# EAGLE schematic EnguinoAuxDisplaySchematic (EAGLE 8.3.1)
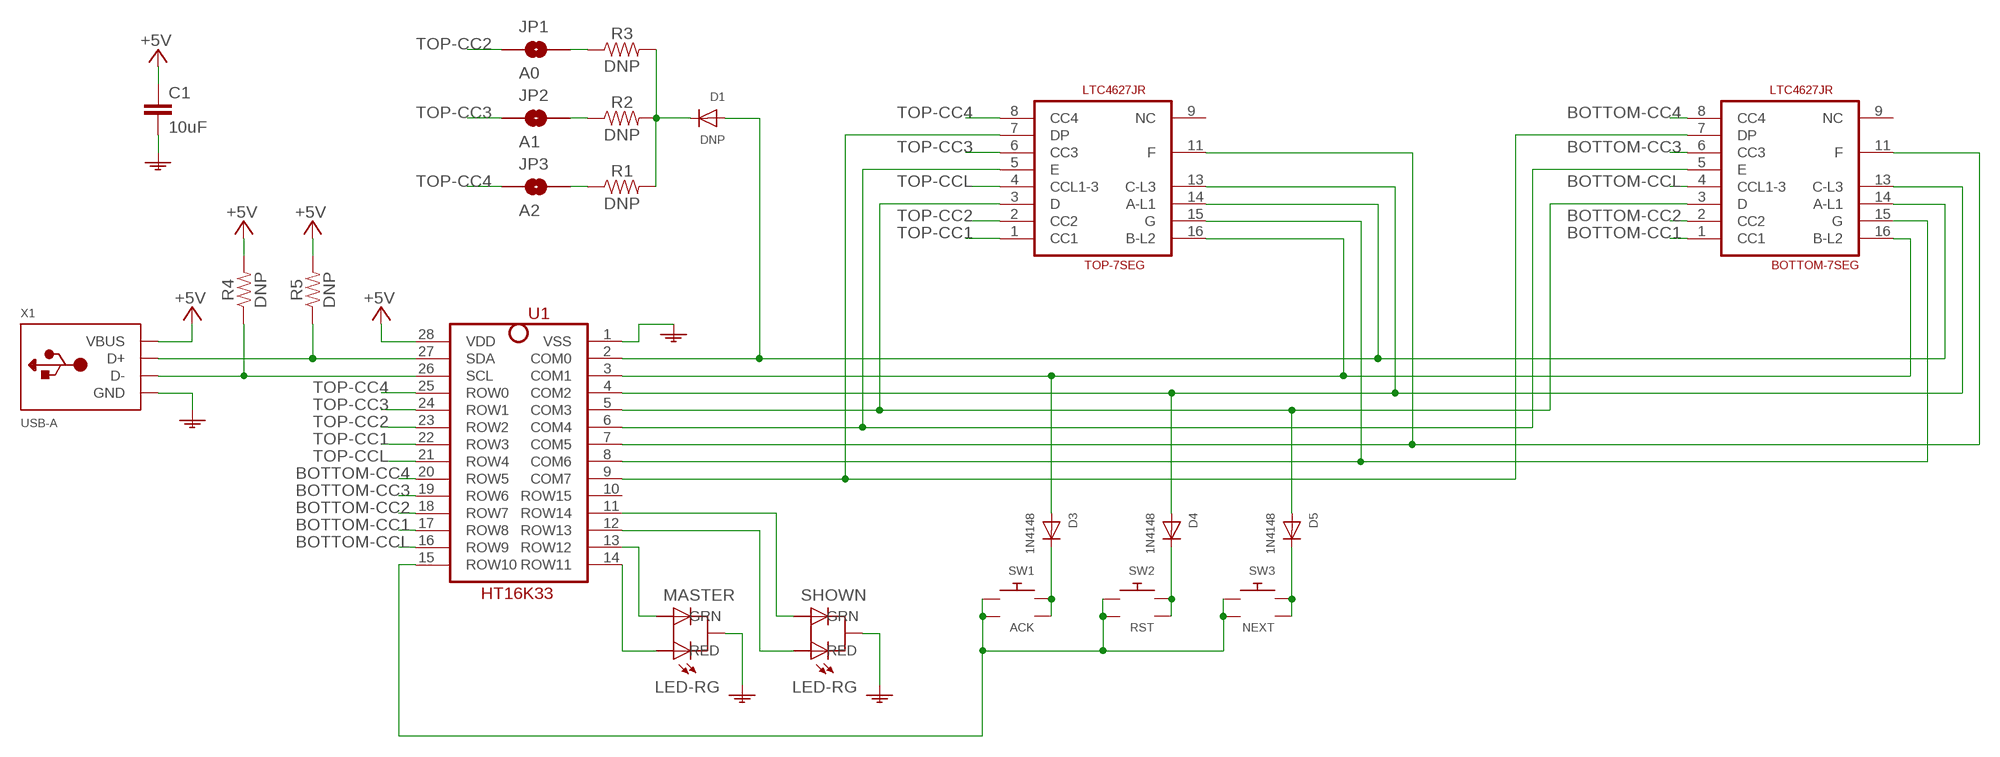
[diagram p0: schematic, sheet 1]

## Parts
BOTTOM-7SEG  LTC4627JR  [7SEG-LED]
C1  10uF  10UF-0805-10V-10%  [0805]
D1  DNP  DIODESOD-123  [SOD-123]
D3  1N4148  DIODESOD-123  [SOD-123]
D4  1N4148  DIODESOD-123  [SOD-123]
D5  1N4148  DIODESOD-123  [SOD-123]
JP1  A0  JUMPER-SMT_2_NO_SILK  [SMT-JUMPER_2_NO_SILK]
JP2  A1  JUMPER-SMT_2_NO_SILK  [SMT-JUMPER_2_NO_SILK]
JP3  A2  JUMPER-SMT_2_NO_SILK  [SMT-JUMPER_2_NO_SILK]
MASTER  LED-RG  [LED-2-5MM]
R1  DNP  47KOHM-0603-1/10W-1%  [0603]
R2  DNP  47KOHM-0603-1/10W-1%  [0603]
R3  DNP  47KOHM-0603-1/10W-1%  [0603]
R4  DNP  22KOHM-0603-1/10W-1%  [0603]
R5  DNP  22KOHM-0603-1/10W-1%  [0603]
SHOWN  LED-RG  [LED-2-5MM]
SW1  ACK  PUSHBUTTON  [BUTTON-TH]
SW2  RST  PUSHBUTTON  [BUTTON-TH]
SW3  NEXT  PUSHBUTTON  [BUTTON-TH]
TOP-7SEG  LTC4627JR  [7SEG-LED]
U1  HT16K33  [SOP28]
X1  USB-A  [USB-A-AMPHENOL]

## Nets
0V: C1.2 MASTER.2(CC) SHOWN.2(CC) U1.1(VSS) X1.P$4(GND)
1N41N8: SW1.3 SW1.4 SW2.3 SW2.4 SW3.3 SW3.4 U1.15(ROW10)
+5V: C1.1 R4.2 R5.2 U1.28(VDD) X1.P$1(VBUS)
BOTTOM-CC1: BOTTOM-7SEG.1(CC1) U1.17(ROW8)
BOTTOM-CC2: BOTTOM-7SEG.2(CC2) U1.18(ROW7)
BOTTOM-CC3: BOTTOM-7SEG.6(CC3) U1.19(ROW6)
BOTTOM-CC4: BOTTOM-7SEG.8(CC4) U1.20(ROW5)
BOTTOM-CCL: BOTTOM-7SEG.4(CCL1-3) U1.16(ROW9)
N$1: JP1.2 R3.1
N$2: R5.1 U1.27(SDA) X1.P$3(D+)
N$3: BOTTOM-7SEG.14(A-L1) D1.A TOP-7SEG.14(A-L1) U1.2(COM0)
N$4: BOTTOM-7SEG.16(B-L2) D3.A TOP-7SEG.16(B-L2) U1.3(COM1)
N$5: BOTTOM-7SEG.13(C-L3) D4.A TOP-7SEG.13(C-L3) U1.4(COM2)
N$6: BOTTOM-7SEG.3(D) D5.A TOP-7SEG.3(D) U1.5(COM3)
N$7: BOTTOM-7SEG.5(E) TOP-7SEG.5(E) U1.6(COM4)
N$8: BOTTOM-7SEG.11(F) TOP-7SEG.11(F) U1.7(COM5)
N$9: BOTTOM-7SEG.15(G) TOP-7SEG.15(G) U1.8(COM6)
N$10: BOTTOM-7SEG.7(DP) TOP-7SEG.7(DP) U1.9(COM7)
N$11: R4.1 U1.26(SCL) X1.P$2(D-)
N$12: JP2.2 R2.1
N$13: JP3.2 R1.1
N$14: D1.C R1.2 R2.2 R3.2
N$16: D3.C SW1.1 SW1.2
N$17: D4.C SW2.1 SW2.2
N$19: D5.C SW3.1 SW3.2
N$20: MASTER.1(RED) U1.14(ROW11)
N$22: MASTER.3(GRN) U1.13(ROW12)
N$23: SHOWN.1(RED) U1.12(ROW13)
N$24: SHOWN.3(GRN) U1.11(ROW14)
TOP-CC1: TOP-7SEG.1(CC1) U1.22(ROW3)
TOP-CC2: JP1.1 TOP-7SEG.2(CC2) U1.23(ROW2)
TOP-CC3: JP2.1 TOP-7SEG.6(CC3) U1.24(ROW1)
TOP-CC4: JP3.1 TOP-7SEG.8(CC4) U1.25(ROW0)
TOP-CCL: TOP-7SEG.4(CCL1-3) U1.21(ROW4)
Unconnected: BOTTOM-7SEG.9(NC) TOP-7SEG.9(NC) U1.10(ROW15)

## Library data of the parts
BOTTOM-7SEG TOP-7SEG = 1Library:LTC4627JR
C1 = SparkFun-Capacitors:10UF: 10.0µF ceramic capacitors A capacitor is a passive two-terminal electrical component used to store electrical energy temporarily in an electric field.; PROD_ID: CAP-11330
D1 = 1Library:DIODE: Diode SMADIODE - SMA Surface Mount Package 20V 1A Schottky Diode Digikey: 641-1014-6-ND DO-1N4148 - Through Hole Small Current Diode SOD-123 20V 1 A (.5mV Vf) Schottky Diode - Digikey: MBRX120TPMSCT-ND SOD-323 10V 570mA (.38mV Vf, 3ns) Schottky Diode - Digikey: ZLLS410CT-ND SOD-523 30V 30mA Schottky Diode (RB751S-40TE61) - Digikey: RB751S-40TE61CT-ND SOT23-R/W - SOT23 Package (R = Solder Paste/Reflow Ovens, W = Hand-Soldering) BAT54Film 40V 300mA - Digikey: 497-7162-1-ND; VALUE: 1N4148
D3-D5 = 1Library:DIODE: Diode SMADIODE - SMA Surface Mount Package 20V 1A Schottky Diode Digikey: 641-1014-6-ND DO-1N4148 - Through Hole Small Current Diode SOD-123 20V 1 A (.5mV Vf) Schottky Diode - Digikey: MBRX120TPMSCT-ND SOD-323 10V 570mA (.38mV Vf, 3ns) Schottky Diode - Digikey: ZLLS410CT-ND SOD-523 30V 30mA Schottky Diode (RB751S-40TE61) - Digikey: RB751S-40TE61CT-ND SOT23-R/W - SOT23 Package (R = Solder Paste/Reflow Ovens, W = Hand-Soldering) BAT54Film 40V 300mA - Digikey: 497-7162-1-ND
JP1-JP3 = SparkFun-Jumpers:JUMPER-SMT_2_NO: Normally open jumper This jumper has two pads in close proximity to each other. Apply solder to close the connection. Round pads are easier to solder for beginners, but are a lot larger. SparkFun Product that uses the round pads: SparkFun EL Sequencer <https://www.sparkfun.com/products/12781>
MASTER SHOWN = 1Library:LED-RG
R1-R3 = SparkFun-Resistors:47KOHM: 47kΩ resistor A resistor is a passive two-terminal electrical component that implements electrical resistance as a circuit element. Resistors act to reduce current flow, and, at the same time, act to lower voltage levels within circuits. - Wikipedia; PROD_ID: RES-07871; VALUE: 47k
R4 R5 = SparkFun-Resistors:22KOHM: 22kΩ resistor A resistor is a passive two-terminal electrical component that implements electrical resistance as a circuit element. Resistors act to reduce current flow, and, at the same time, act to lower voltage levels within circuits. - Wikipedia; PROD_ID: RES-07853; VALUE: 22k
SW1-SW3 = 1Library:PUSHBUTTON: Tactile pushbutton SPST NO Digikey 450-1642-ND Digikey <https://www.digikey.com/product-detail/en/te-connectivity-alcoswitch-switches/2-1825910-7/450-1642-ND/1632528>
U1 = 1Library:HT16K33
X1 = 1Library:USB-A: USB type A 'plug' Used for things that can directly connect to a USB port, say USB key